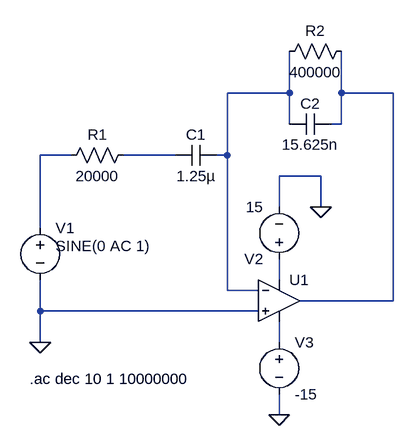
[diagram p0: schematic ej3.asc]
ej3.asc, the LTspice schematic file:
Version 4
SHEET 1 880 680
WIRE 128 -208 128 -272
WIRE 128 -208 32 -208
WIRE 208 -208 208 -272
WIRE 288 -208 208 -208
WIRE 128 -160 128 -208
WIRE 208 -160 208 -208
WIRE 208 -160 192 -160
WIRE -208 -112 -256 -112
WIRE -48 -112 -128 -112
WIRE 32 -112 32 -208
WIRE 32 -112 16 -112
WIRE 176 -80 112 -80
WIRE 112 -32 112 -80
WIRE 176 -32 176 -80
WIRE -256 0 -256 -112
WIRE 112 80 112 48
WIRE 32 96 32 -112
WIRE 80 96 32 96
WIRE 288 112 288 -208
WIRE 288 112 144 112
WIRE -256 128 -256 80
WIRE 80 128 -256 128
WIRE -256 176 -256 128
WIRE 112 176 112 144
WIRE 112 288 112 256
FLAG -256 176 0
FLAG 112 288 0
FLAG 176 -32 0
SYMBOL res -112 -128 R90
WINDOW 0 0 56 VBottom 2
WINDOW 3 32 56 VTop 2
SYMATTR InstName R1
SYMATTR Value 20000
SYMBOL res 224 -288 R90
WINDOW 0 0 56 VBottom 2
WINDOW 3 32 56 VTop 2
SYMATTR InstName R2
SYMATTR Value 400000
SYMBOL cap 16 -128 R90
WINDOW 0 0 32 VBottom 2
WINDOW 3 32 32 VTop 2
SYMATTR InstName C1
SYMATTR Value 1.25µ
SYMBOL cap 192 -176 R90
WINDOW 0 0 32 VBottom 2
WINDOW 3 32 32 VTop 2
SYMATTR InstName C2
SYMATTR Value 15.625n
SYMBOL voltage -256 -16 R0
WINDOW 3 24 44 Left 2
WINDOW 123 0 0 Left 0
WINDOW 39 0 0 Left 0
SYMATTR InstName V1
SYMATTR Value SINE(0 AC 1)
SYMBOL voltage 112 64 R180
WINDOW 123 0 0 Left 0
WINDOW 39 0 0 Left 0
SYMATTR InstName V2
SYMATTR Value 15
SYMBOL voltage 112 160 R0
WINDOW 123 0 0 Left 0
WINDOW 39 0 0 Left 0
SYMATTR InstName V3
SYMATTR Value -15
SYMBOL OpAmps\\UniversalOpAmp 112 112 R0
SYMATTR InstName U1
TEXT -272 232 Left 2 !.ac dec 10 1 10000000

The netlist it stands for:
* ej3.asc
R1 N004 N003 20000
R2 N002 N001 400000
C1 N001 N004 1.25µ
C2 N002 N001 15.625n
V1 N003 0 SINE(0 AC 1)
V2 N005 0 15
V3 N006 0 -15
XU1 0 N001 N005 N006 N002 level1 Avol=1Meg GBW=10Meg Vos=0 En=0 Enk=0 In=0 Ink=0 Rin=500Meg  ; pins In+ In- V+ V- OUT
.ac dec 10 1 10000000
.lib UniversalOpAmp1.lib
.backanno
.end